# Altium schematic sheet Sheet1.SchDoc
size A3
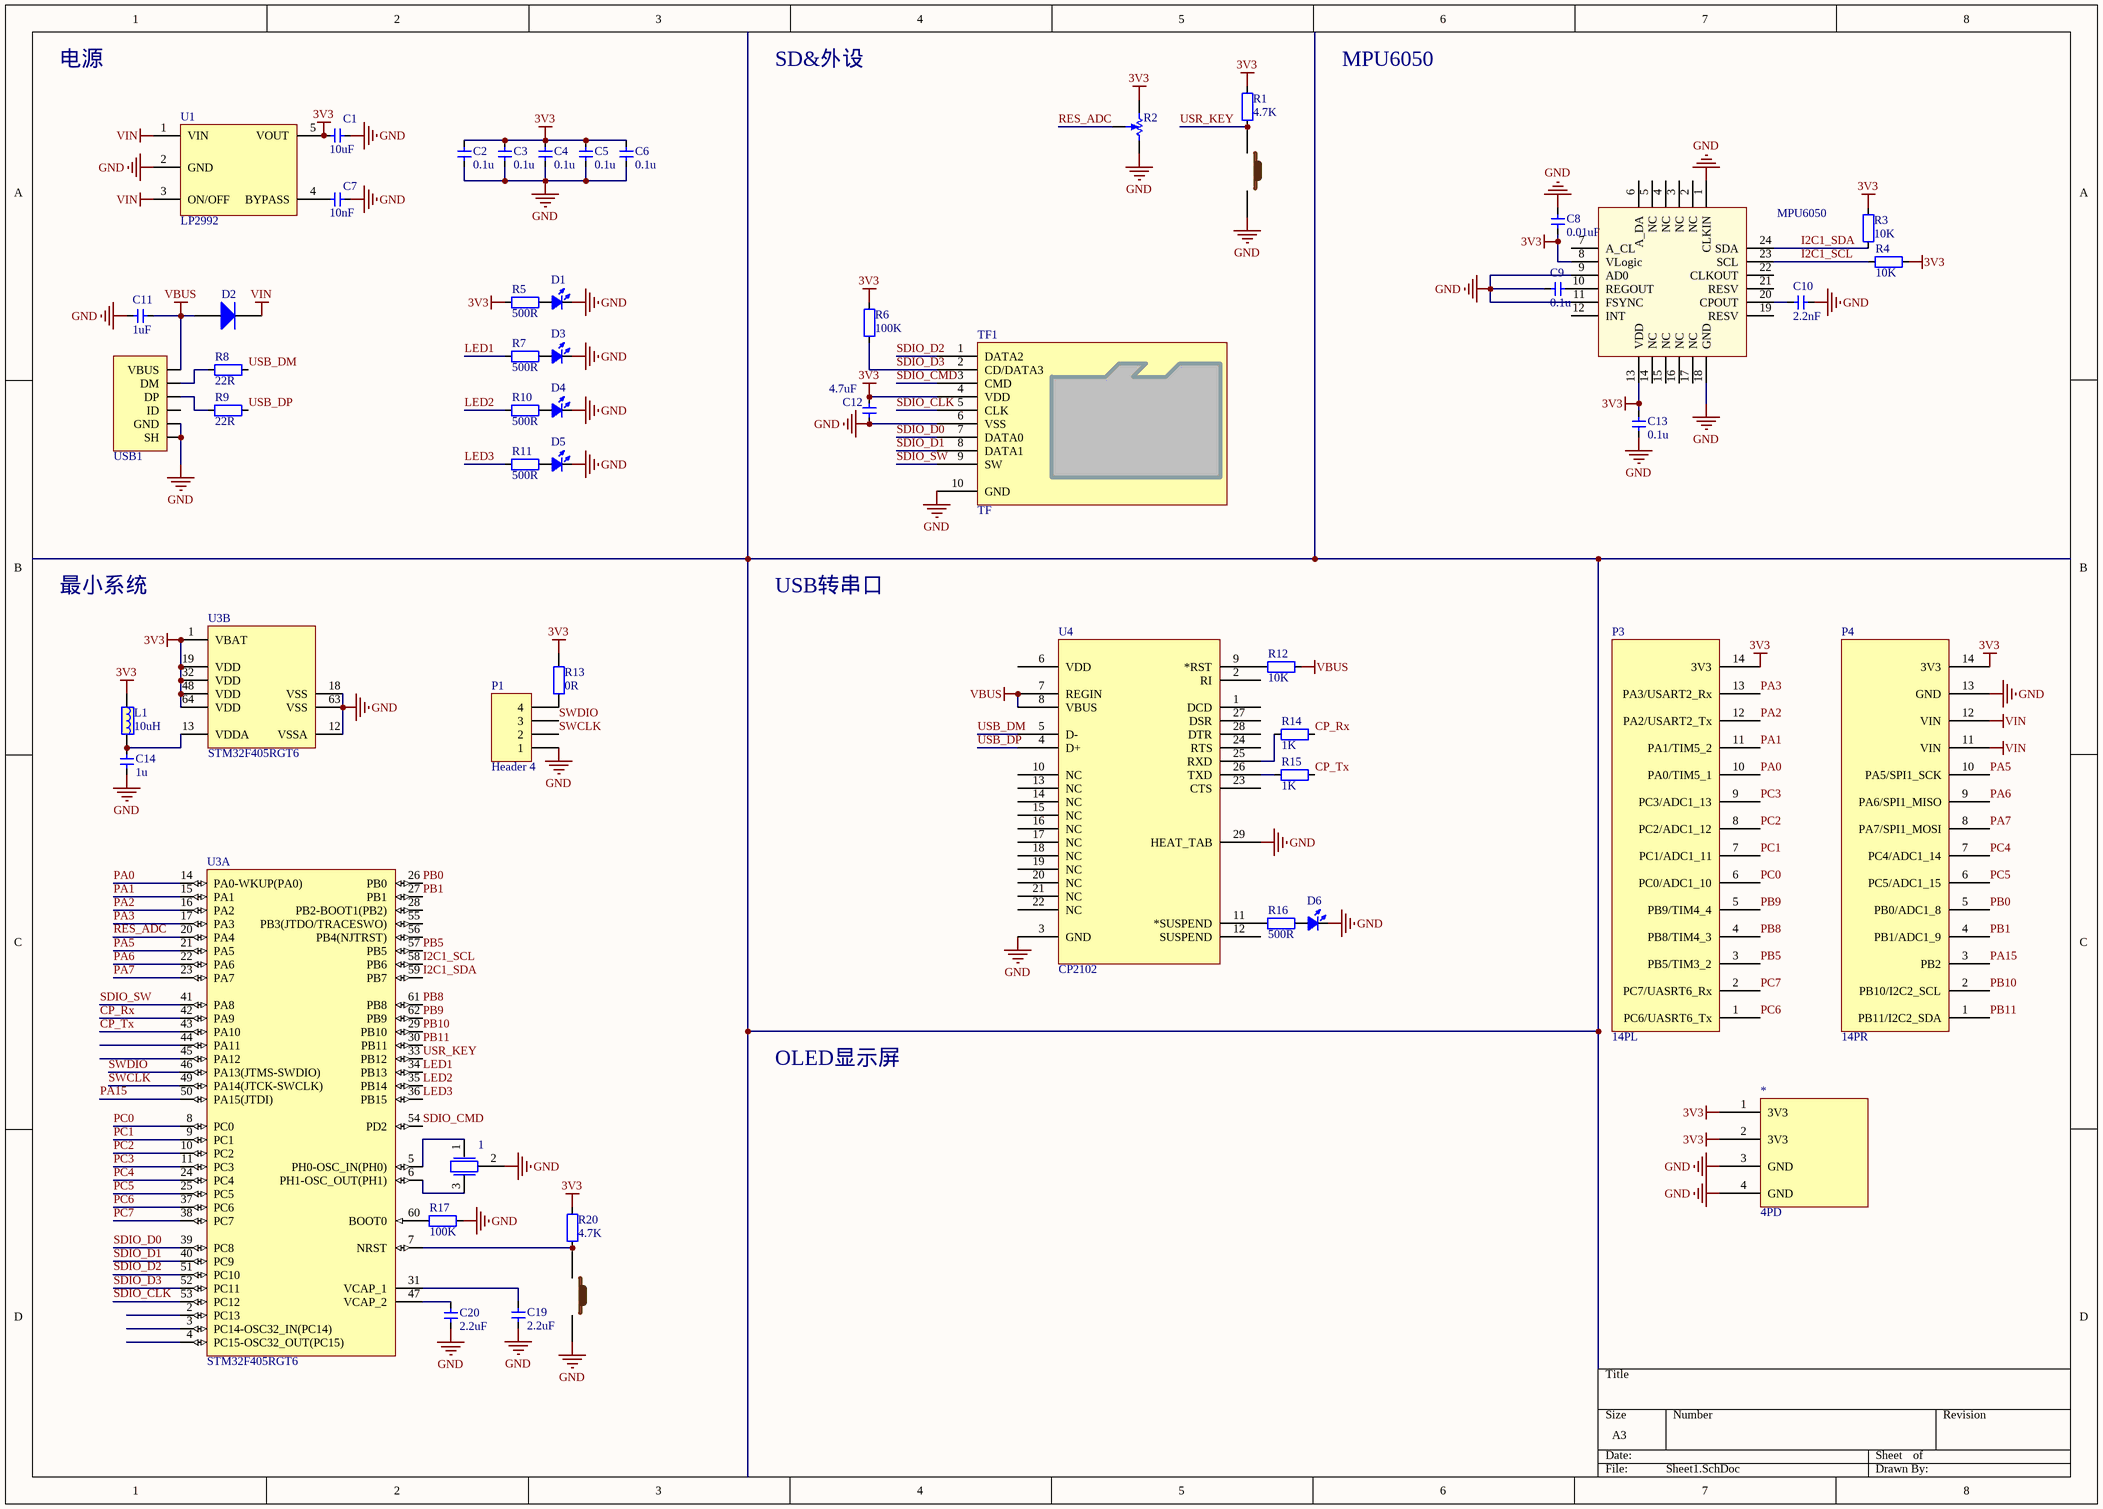
[diagram p0: Sheet1.SchDoc]

## Parts
1  晶振-3Pin  [晶振-3P]  (value not drawn)
*  4PD  [4P]
C1  10uF  [0603-CAP]
C2  value 0.1u  [0603-CAP]  (hidden comment: 0.1uF)
C3  value 0.1u  [0603-CAP]  (hidden comment: 0.1uF)
C4  value 0.1u  [0603-CAP]  (hidden comment: 0.1uF)
C5  value 0.1u  [0603-CAP]  (hidden comment: 电容-0603)
C6  value 0.1u  [0603-CAP]  (hidden comment: 0.1uF)
C7  10nF  [0603-CAP]
C8  0.01uF  [0603-CAP]
C9  value 0.1u  [0603-CAP]  (hidden comment: 0.1uF)
C10  2.2nF  [0603-CAP]
C11  1uF  [0603-CAP]
C12  4.7uF  [0603-CAP]
C13  value 0.1u  [0603-CAP]  (hidden comment: 0.1uF)
C14  value 1u  [0603-CAP]  (hidden comment: 1uF)
C19  2.2uF  [0603-CAP]
C20  2.2uF  [0603-CAP]
D1  LED-0603  [0603-LED-BLUE]  (value not drawn)
D2  二极管-5819W  [SOD-123]  (value not drawn)
D3  LED-0603  [0603-LED-BLUE]  (value not drawn)
D4  LED-0603  [0603-LED-BLUE]  (value not drawn)
D5  LED-0603  [0603-LED-BLUE]  (value not drawn)
D6  LED-0603  [0603-LED-BLUE]  (value not drawn)
L1  10uH  [0805-L]
P1  Header 4  [HDR1X4]
P3  14PL  [14P]
P4  14PR  [14P]
R1  4.7K  [0603-RES]
R2  电位器-贴片  [贴片电位器 3*3]  (value not drawn)
R3  10K  [0603-RES]
R4  10K  [0603-RES]
R5  500R  [0603-RES]
R6  100K  [0603-RES]
R7  500R  [0603-RES]
R8  22R  [0603-RES]
R9  22R  [0603-RES]
R10  500R  [0603-RES]
R11  500R  [0603-RES]
R12  10K  [0603-RES]
R13  value 0R  [0402-0R]  (hidden comment: 电阻-0R)
R14  1K  [0603-RES]
R15  1K  [0603-RES]
R16  500R  [0603-RES]
R17  100K  [0603-RES]
R20  4.7K  [0603-RES]
TF1  TF  [TF-SOCKET]
U1  LP2992  [SOT23-5]
U2  MPU6050  [QFN-24]
U3  STM32F405RGT6  [LQFP-64_N]  (parts A,B of 2)
U4  CP2102  [QFN-28]
USB1  USB-Micro  [USB_Micro-AB]  (value not drawn)
按键1  Reset  [SW-KEY2]  (value not drawn)
按键2  Reset  [SW-KEY2]  (value not drawn)

## Nets
3V3: *.1(3V3) *.2(3V3) C1.2 C2.1 C3.1 C4.1 C5.1 C6.1 C8.2 C12.1 C13.2 L1.1 P3.14(3V3) P4.14(3V3) R1.2 R2.2(-) R3.2 R4.2 R5.1 R6.2 R13.2 R20.2 TF1.4(VDD) U1.5(VOUT) U2.8(VLogic) U2.13(VDD) U3.1(VBAT) U3.19(VDD) U3.32(VDD) U3.48(VDD) U3.64(VDD)
GND: 1.2 *.3(GND) *.4(GND) C1.1 C2.2 C3.2 C4.2 C5.2 C6.2 C7.1 C8.1 C9.1 C10.2 C11.1 C12.2 C13.1 C14.1 C19.1 C20.1 D1.2(K) D3.2(K) D4.2(K) D5.2(K) D6.2(K) P1.1 P4.13(GND) R2.1(+) R17.2 TF1.6(VSS) TF1.10(GND) U1.2(GND) U2.1(CLKIN) U2.9(AD0) U2.11(FSYNC) U2.18(GND) U3.12(VSSA) U3.18(VSS) U3.63(VSS) U4.3(GND) U4.29(HEAT_TAB) USB1.0(SH) USB1.5(GND) 按键1.2 按键2.2
VBUS: C11.2 D2.1(A) R12.2 U4.7(REGIN) U4.8(VBUS) USB1.1(VBUS)
VIN: D2.2(K) P4.11(VIN) P4.12(VIN) U1.1(VIN) U1.3(ON/OFF)
CP_Rx: R14.2 U3.42(PA9)
CP_Tx: R15.2 U3.43(PA10)
I2C1_SCL: R4.1 U2.23(SCL) U3.58(PB6)
I2C1_SDA: R3.1 U2.24(SDA) U3.59(PB7)
LED1: R7.1 U3.34(PB13)
LED2: R10.1 U3.35(PB14)
LED3: R11.1 U3.36(PB15)
PA0: P3.10(PA0/TIM5_1) U3.14(PA0-WKUP(PA0))
PA1: P3.11(PA1/TIM5_2) U3.15(PA1)
PA2: P3.12(PA2/USART2_Tx) U3.16(PA2)
PA3: P3.13(PA3/USART2_Rx) U3.17(PA3)
PA5: P4.10(PA5/SPI1_SCK) U3.21(PA5)
PA6: P4.9(PA6/SPI1_MISO) U3.22(PA6)
PA7: P4.8(PA7/SPI1_MOSI) U3.23(PA7)
PA15: P4.3(PB2) U3.50(PA15(JTDI))
PB0: P4.5(PB0/ADC1_8) U3.26(PB0)
PB1: P4.4(PB1/ADC1_9) U3.27(PB1)
PB5: P3.3(PB5/TIM3_2) U3.57(PB5)
PB8: P3.4(PB8/TIM4_3) U3.61(PB8)
PB9: P3.5(PB9/TIM4_4) U3.62(PB9)
PB10: P4.2(PB10/I2C2_SCL) U3.29(PB10)
PB11: P4.1(PB11/I2C2_SDA) U3.30(PB11)
PC0: P3.6(PC0/ADC1_10) U3.8(PC0)
PC1: P3.7(PC1/ADC1_11) U3.9(PC1)
PC2: P3.8(PC2/ADC1_12) U3.10(PC2)
PC3: P3.9(PC3/ADC1_13) U3.11(PC3)
PC4: P4.7(PC4/ADC1_14) U3.24(PC4)
PC5: P4.6(PC5/ADC1_15) U3.25(PC5)
PC6: P3.1(PC6/UASRT6_Tx) U3.37(PC6)
PC7: P3.2(PC7/UASRT6_Rx) U3.38(PC7)
RES_ADC: R2.3(W) U3.20(PA4)
SDIO_CLK: TF1.5(CLK) U3.53(PC12)
SDIO_CMD: TF1.3(CMD) U3.54(PD2)
SDIO_D0: TF1.7(DATA0) U3.39(PC8)
SDIO_D1: TF1.8(DATA1) U3.40(PC9)
SDIO_D2: TF1.1(DATA2) U3.51(PC10)
SDIO_D3: R6.1 TF1.2(CD/DATA3) U3.52(PC11)
SDIO_SW: TF1.9(SW) U3.41(PA8)
SWCLK: P1.2 U3.49(PA14(JTCK-SWCLK))
SWDIO: P1.3 U3.46(PA13(JTMS-SWDIO))
USB_DM: R8.2 U4.5(D-)
USB_DP: R9.2 U4.4(D+)
USR_KEY: R1.1 U3.33(PB12) 按键1.1
Net1_1: 1.1 U3.5(PH0-OSC_IN(PH0))
Net1_3: 1.3 U3.6(PH1-OSC_OUT(PH1))
NetC7_2: C7.2 U1.4(BYPASS)
NetC9_2: C9.2 U2.10(REGOUT)
NetC10_1: C10.1 U2.20(CPOUT)
NetC14_2: C14.2 L1.2 U3.13(VDDA)
NetC19_2: C19.2 U3.31(VCAP_1)
NetC20_2: C20.2 U3.47(VCAP_2)
NetD1_1: D1.1(A) R5.2
NetD3_1: D3.1(A) R7.2
NetD4_1: D4.1(A) R10.2
NetD5_1: D5.1(A) R11.2
NetD6_1: D6.1(A) R16.2
NetP1_4: P1.4 R13.1
NetR8_1: R8.1 USB1.2(DM)
NetR9_1: R9.1 USB1.3(DP)
NetR12_1: R12.1 U4.9(*RST)
NetR14_1: R14.1 U4.25(RXD)
NetR15_1: R15.1 U4.26(TXD)
NetR16_1: R16.1 U4.11(*SUSPEND)
NetR17_1: R17.1 U3.60(BOOT0)
NetR20_1: R20.1 U3.7(NRST) 按键2.1

Not connected (* = marked no-connect by the designer): U2 2(NC) 3(NC) 4(NC) 5(NC) 6(A_DA) 7(A_CL) 12(INT) 14(NC) 15(NC) 16(NC) 17(NC) 19(RESV) 21(RESV) 22(CLKOUT); U3 2(PC13) 3(PC14-OSC32_IN(PC14)) 4(PC15-OSC32_OUT(PC15)) 28(PB2-BOOT1(PB2)) 44(PA11) 45(PA12) 55(PB3(JTDO/TRACESWO)) 56(PB4(NJTRST)); U4 1(DCD) 2(RI) 6(VDD) 10(NC) 12(SUSPEND) 13(NC) 14(NC) 15(NC) 16(NC) 17(NC) 18(NC) 19(NC) 20(NC) 21(NC) 22(NC) 23(CTS) 24(RTS) 27(DSR) 28(DTR); USB1 4(ID)

## Notes on the sheet
- 电源
- SD&外设
- MPU6050
- 最小系统
- USB转串口
- OLED显示屏

## Library data of the parts
1 = 晶振-3Pin: 村田贴片
C1-C14 C19 C20 = 电容-0603: Capacitor
  C1: Value: 10uF
  C7: Value: 10nF
  C8: Value: 0.01uF
  C10: Value: 2.2nF
  C11: Value: 1uF
  C12: Value: 4.7uF
  C19 C20: Value: 2.2uF
D1 D3-D6 = LED-0603: LED
D2 = 二极管-5819W: 40V
L1 = 电感-0805: 磁珠
P1 = Header 4: Header, 4-Pin; LatestRevisionDate: 17-Jul-2002; LatestRevisionNote: Re-released for DXP Platform.; Publisher: Altium Limited
R1 R3-R12 R14-R17 R20 = 电阻-0603: Resistor
  R1 R20: Value: 4.7K
  R3 R4 R12: Value: 10K
  R5 R7 R10 R11 R16: Value: 500R
  R6 R17: Value: 100K
  R8 R9: Value: 22R
  R14 R15: Value: 1K
R13 = 电阻-0R: Resistor; Published: 8-Jun-2000; LatestRevisionDate: 17-Jul-2002; LatestRevisionNote: Re-released for DXP Platform.; PackageReference: AXIAL-0.4; Publisher: Altium Limited; PackageDescription: Axial Device, Thru-Hole; 2 Leads; 0.4 in Pin Spacing
TF1 = TF卡座: 8脚自弹
U1 = LP2992: LDO
U2 = MPU6050: 六轴传感器
U3 = STM32F405RGT6: MCU+FPU
U4 = CP2102: USB转TTL; PART DESC: SINGLE-CHIP USB TO UART BRIDGE, QFN28, RoHS.; MFG #1: SILICON LABS; PART NUMBER: CP2102; Value: Value; RefDes: RefDes; Type: DEV
USB1 = USB-Micro: USB
按键1 按键2 = 按键-4Pin: 贴片轻触
R2 = 电位器-贴片: Published: 17-Dec-2003; DatasheetVersion: Oct-2003; PackageReference: POT4MM-2; Publisher: Altium Limited; PackageDescription: Square Trimming Potentiometer; ComponentLink1Description: Manufacturer Link; ComponentLink1URL: http://bourns.com/2/search.html